# Altium schematic sheet IMU.SchDoc
size Tabloid; SheetNumber: 2; SheetTotal: 2
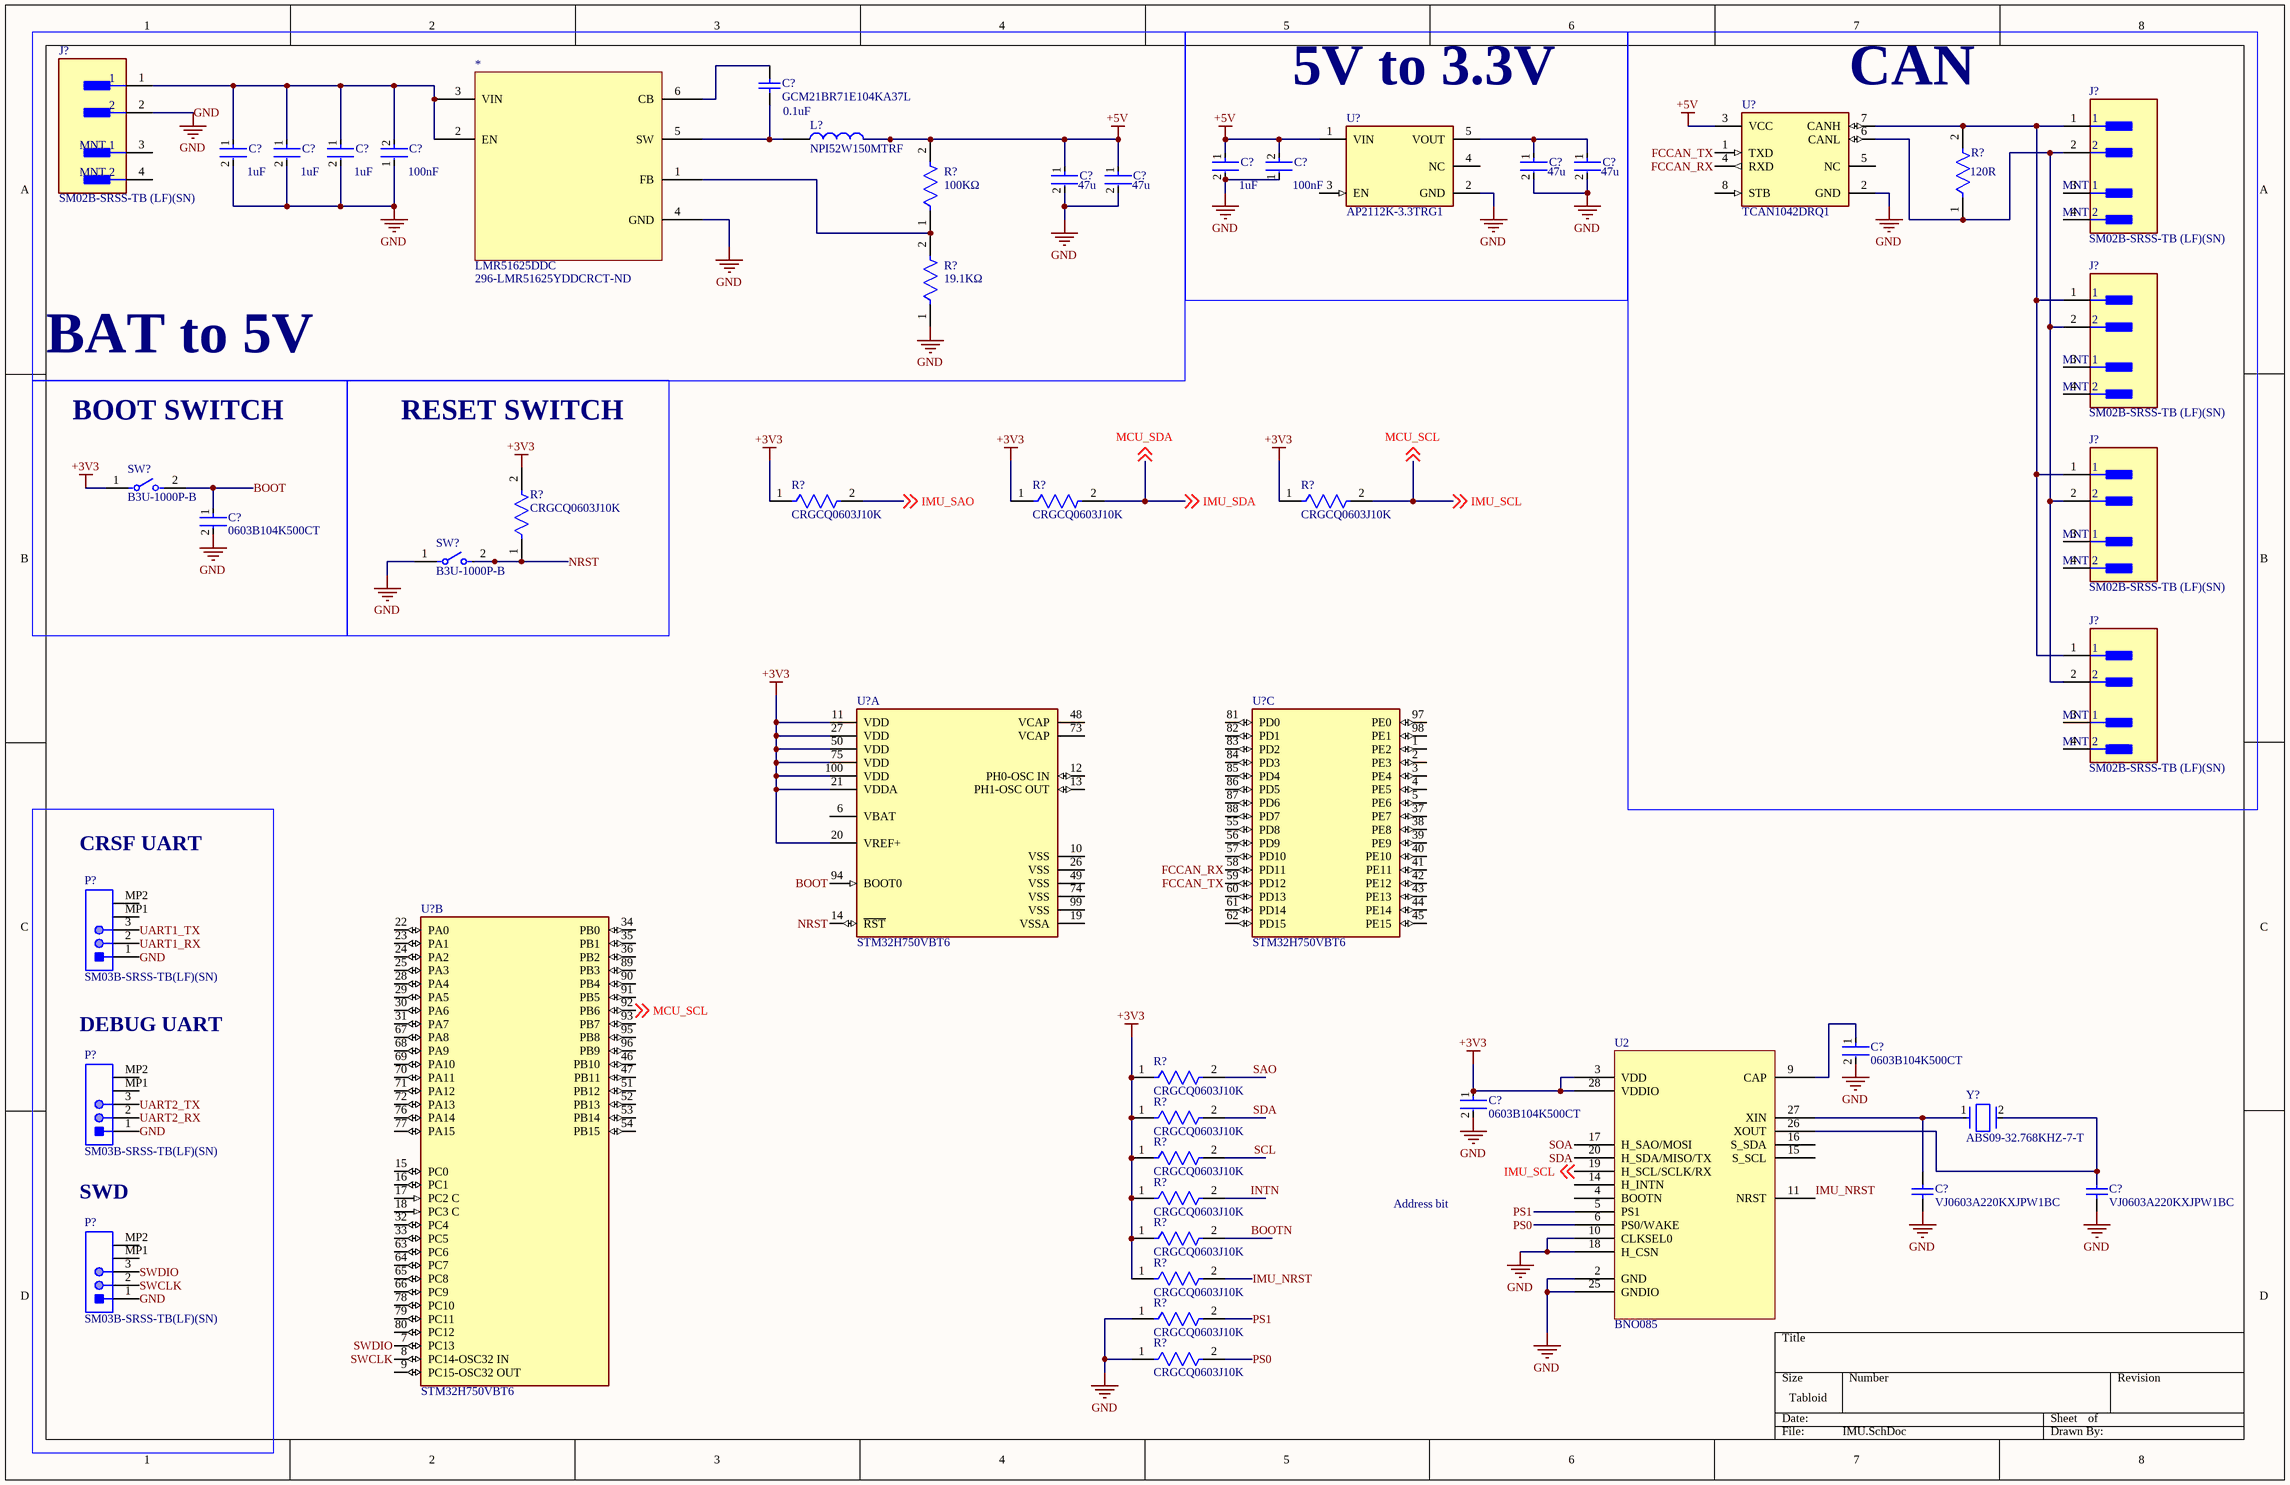
[diagram p0: IMU.SchDoc]

## Parts
(Parts that share a designator on the sheet are numbered #1, #2 ... from top to bottom, then left to right.)
*  LMR51625DDC  Supplier Part Number 1: 296-LMR51625YDDCRCT-ND  [SOT23-6]
C?#1  GCM21BR71E104KA37L  value 0.1uF  [CAPC2013X140X45LL15T25]
C?#2  Capacitance: 1uF  [FP-GCJ31M-0_3-IPC_C]  (hidden comment: GCJ31MR71H105KA12K)
C?#3  Capacitance: 1uF  [FP-GCJ31M-0_3-IPC_C]  (hidden comment: GCJ31MR71H105KA12K)
C?#4  Capacitance: 1uF  [FP-GCJ31M-0_3-IPC_C]  (hidden comment: GCJ31MR71H105KA12K)
C?#5  Capacitance: 100nF  [FP-C1608-080-0_1-IPC_B]  (hidden comment: C1608X7R1H104K080AA)
C?#6  Capacitance: 1uF  [FP-GCJ31M-0_3-IPC_C]  (hidden comment: GCJ31MR71H105KA12K)
C?#7  Capacitance: 100nF  [FP-C1608-080-0_1-IPC_B]  (hidden comment: C1608X7R1H104K080AA)
C?#8  Capacitance: 47u  [FP-GRJ32E-0_4-0_3-MFG]  (hidden comment: GRJ32ER71A476KE11K)
C?#9  Capacitance: 47u  [FP-GRJ32E-0_4-0_3-MFG]  (hidden comment: GRJ32ER71A476KE11K)
C?#10  Capacitance: 47u  [FP-GRJ32E-0_4-0_3-MFG]  (hidden comment: GRJ32ER71A476KE11K)
C?#11  Capacitance: 47u  [FP-GRJ32E-0_4-0_3-MFG]  (hidden comment: GRJ32ER71A476KE11K)
C?#12  0603B104K500CT  [FP-0603B104K500CT-IPC_C]
C?#13  0603B104K500CT  [FP-0603B104K500CT-IPC_C]
C?#14  0603B104K500CT  [FP-0603B104K500CT-IPC_C]
C?#15  VJ0603A220KXJPW1BC  [CAPC1608X95X40ML15T15]
C?#16  VJ0603A220KXJPW1BC  [CAPC1608X95X40ML15T15]
J?#1  SM02B-SRSS-TB (LF)(SN)  [FP-SM02B-SRSS-TB_LF_SN-MFG]
J?#2  SM02B-SRSS-TB (LF)(SN)  [FP-SM02B-SRSS-TB_LF_SN-MFG]
J?#3  SM02B-SRSS-TB (LF)(SN)  [FP-SM02B-SRSS-TB_LF_SN-MFG]
J?#4  SM02B-SRSS-TB (LF)(SN)  [FP-SM02B-SRSS-TB_LF_SN-MFG]
J?#5  SM02B-SRSS-TB (LF)(SN)  [FP-SM02B-SRSS-TB_LF_SN-MFG]
L?  NPI52W150MTRF  [NPI52W150MTRF]
P?#1  SM03B-SRSS-TB(LF)(SN)  [JST-SM03B-SRSS-TB_V]
P?#2  SM03B-SRSS-TB(LF)(SN)  [JST-SM03B-SRSS-TB_V]
P?#3  SM03B-SRSS-TB(LF)(SN)  [JST-SM03B-SRSS-TB_V]
R?#1  Resistance: 120R  [FP-RMCF0603-IPC_A]  (hidden comment: RMCF0603JT120R)
R?#2  value 100KΩ  [FP-CRGCQ0603-IPC_C]  (hidden comment: CRGCQ0603J100K)
R?#3  value 19.1KΩ  [FP-CPF0603-MFG]  (hidden comment: CPF0603F19K1C1)
R?#4  CRGCQ0603J10K  [FP-CRGCQ0603-IPC_C]
R?#5  CRGCQ0603J10K  [FP-CRGCQ0603-IPC_C]
R?#6  CRGCQ0603J10K  [FP-CRGCQ0603-IPC_C]
R?#7  CRGCQ0603J10K  [FP-CRGCQ0603-IPC_C]
R?#8  CRGCQ0603J10K  [FP-CRGCQ0603-IPC_C]
R?#9  CRGCQ0603J10K  [FP-CRGCQ0603-IPC_C]
R?#10  CRGCQ0603J10K  [FP-CRGCQ0603-IPC_C]
R?#11  CRGCQ0603J10K  [FP-CRGCQ0603-IPC_C]
R?#12  CRGCQ0603J10K  [FP-CRGCQ0603-IPC_C]
R?#13  CRGCQ0603J10K  [FP-CRGCQ0603-IPC_C]
R?#14  CRGCQ0603J10K  [FP-CRGCQ0603-IPC_C]
R?#15  CRGCQ0603J10K  [FP-CRGCQ0603-IPC_C]
SW?#1  B3U-1000P-B  [FP-B3U-1000P-B-MFG]
SW?#2  B3U-1000P-B  [FP-B3U-1000P-B-MFG]
U2  BNO085  [LGA28]
U?#1  TCAN1042DRQ1  [FP-D0008B-MFG]
U?#2  AP2112K-3.3TRG1  [FP-SOT25-IPC_A]
U?#3  STM32H750VBT6  [FP-LQFP100-1L-MFG]  (part A of 3)
U?#4  STM32H750VBT6  [FP-LQFP100-1L-MFG]  (part C of 3)
U?#5  STM32H750VBT6  [FP-LQFP100-1L-MFG]  (part B of 3)
Y?  ABS09-32.768KHZ-7-T  [FP-ABS09-MFG]

## Blocks framed on the sheet
5V to 3.3V: C?#6-C?#9 U?#2
CAN: J?#2-J?#5 R?#1 U?#1
BAT to 5V: C?#12 SW?#1
RESET SWITCH: R?#7 SW?#2

## Nets
+3V3: C?#14.1 R?#4.1 R?#5.1 R?#6.1 R?#7.2 R?#8.1 R?#9.1 R?#10.1 R?#11.1 R?#12.1 R?#13.1 SW?#1.1 U2.3(VDD) U2.28(VDDIO) U?#3.11(VDD) U?#3.20(VREF+) U?#3.21(VDDA) U?#3.27(VDD) U?#3.50(VDD) U?#3.75(VDD) U?#3.100(VDD)
+5V: C?#6.1 C?#7.2 C?#10.1 C?#11.1 L?.2 R?#2.2 U?#1.3(VCC) U?#2.1(VIN)
GND: *.4(GND) C?#2.2 C?#3.2 C?#4.2 C?#5.1 C?#6.2 C?#7.1 C?#8.2 C?#9.2 C?#10.2 C?#11.2 C?#12.2 C?#13.2 C?#14.2 C?#15.1 C?#16.1 J?#1.2 P?#1.1 P?#2.1 P?#3.1 R?#3.1 R?#14.1 R?#15.1 SW?#2.1 U2.2(GND) U2.10(CLKSEL0) U2.18(H_CSN) U2.25(GNDIO) U?#1.2(GND) U?#2.2(GND)
BOOT: C?#12.1 SW?#1.2 U?#3.94(BOOT0)
BOOTN: R?#12.2
FCCAN_RX: U?#1.4(RXD) U?#4.58(PD11)
FCCAN_TX: U?#1.1(TXD) U?#4.59(PD12)
IMU_NRST: R?#13.2 U2.11(NRST)
IMU_SAO: R?#4.2 ; off-sheet IMU_SAO
IMU_SCL: R?#6.2 U2.19(H_SCL/SCLK/RX) U?#5.92(PB6) ; off-sheet IMU_SCL, off-sheet MCU_SCL  [also labelled MCU_SCL]
IMU_SDA: R?#5.2 ; off-sheet IMU_SDA, off-sheet MCU_SDA  [also labelled MCU_SDA]
INTN: R?#11.2
NRST: R?#7.1 SW?#2.2 U?#3.14(~{RST})
PS0: R?#15.2 U2.6(PS0/WAKE)
PS1: R?#14.2 U2.5(PS1)
SAO: R?#8.2
SCL: R?#10.2
SDA: R?#9.2 U2.20(H_SDA/MISO/TX)
SOA: U2.17(H_SAO/MOSI)
SWCLK: P?#3.2 U?#5.8(PC14-OSC32_IN)
SWDIO: P?#3.3 U?#5.7(PC13)
UART1_RX: P?#1.2
UART1_TX: P?#1.3
UART2_RX: P?#2.2
UART2_TX: P?#2.3
Net*_1: *.1(FB) R?#2.1 R?#3.2
Net*_2: *.2(EN) *.3(VIN) C?#2.1 C?#3.1 C?#4.1 C?#5.2 J?#1.1
Net*_5: *.5(SW) C?#1.1 L?.1
Net*_6: *.6(CB) C?#1.2
NetC?#8_1: C?#8.1 C?#9.1 U?#2.5(VOUT)
NetC?#13_1: C?#13.1 U2.9(CAP)
NetC?#15_2: C?#15.2 U2.27(XIN) Y?.1
NetC?#16_2: C?#16.2 U2.26(XOUT) Y?.2
NetJ?#2_1: J?#2.1 J?#3.1 J?#4.1 J?#5.1 R?#1.2 U?#1.7(CANH)
NetJ?#2_2: J?#2.2 J?#3.2 J?#4.2 J?#5.2 R?#1.1 U?#1.6(CANL)

Not connected (* = marked no-connect by the designer): J?#1 3(MNT_1) 4(MNT_2); J?#2 3(MNT_1) 4(MNT_2); J?#3 3(MNT_1) 4(MNT_2); J?#4 3(MNT_1) 4(MNT_2); J?#5 3(MNT_1) 4(MNT_2); P?#1 MP1 MP2; P?#2 MP1 MP2; P?#3 MP1 MP2; U2 4(BOOTN) 14(H_INTN) 15(S_SCL) 16(S_SDA); U?#1 5(NC) 8(STB); U?#2 3(EN) 4(NC); U?#3 6(VBAT) 10(VSS) 12(PH0-OSC_IN) 13(PH1-OSC_OUT) 19(VSSA) 26(VSS) 48(VCAP) 49(VSS) 73(VCAP) 74(VSS) 99(VSS); U?#4 1(PE2) 2(PE3) 3(PE4) 4(PE5) 5(PE6) 37(PE7) 38(PE8) 39(PE9) 40(PE10) 41(PE11) 42(PE12) 43(PE13) 44(PE14) 45(PE15) 55(PD8) 56(PD9) 57(PD10) 60(PD13) 61(PD14) 62(PD15) 81(PD0) 82(PD1) 83(PD2) 84(PD3) 85(PD4) 86(PD5) 87(PD6) 88(PD7) 97(PE0) 98(PE1); U?#5 9(PC15-OSC32_OUT) 15(PC0) 16(PC1) 17(PC2_C) 18(PC3_C) 22(PA0) 23(PA1) 24(PA2) 25(PA3) 28(PA4) 29(PA5) 30(PA6) 31(PA7) 32(PC4) 33(PC5) 34(PB0) 35(PB1) 36(PB2) 46(PB10) 47(PB11) 51(PB12) 52(PB13) 53(PB14) 54(PB15) 63(PC6) 64(PC7) 65(PC8) 66(PC9) 67(PA8) 68(PA9) 69(PA10) 70(PA11) 71(PA12) 72(PA13) 76(PA14) 77(PA15) 78(PC10) 79(PC11) 80(PC12) 89(PB3) 90(PB4) 91(PB5) 93(PB7) 95(PB8) 96(PB9)

## Notes on the sheet
- BOOT SWITCH
- (near P?#1) CRSF UART
- (near P?#2) DEBUG UART
- (near P?#3) SWD
- Address bit

## Library data of the parts
* = LMR51625DDC: LMR516x5 4.3V to 60V, 2.5A / 3.5A, Synchronous, Buck Converter With Low IQ; Data: *; Supplier 1: DigiKey
C?#1 = CMP-2007-03344-1: Manufacturer: Murata; Part Number: GCM21BR71E104KA37L
C?#2-C?#4 C?#6 = CMP-06035-033047-1: 1uF +/- 10% Ceramic Capacitor, 50VDC, X7R Temperature Coefficient 15% Op Temp -55 to +125°C, 1206 Packaging
C?#5 C?#7 = CMP-2000-04982-2: Multilayer Ceramic Capacitors 100nF ±10% 50V X7R SMD 0603; REACH SVHC: No SVHC; Voltage: 50V; Min Operating Temperature: -55°C; Package Quantity: 1; Case Code (Metric): 1608; Series: C; Termination: SMD/SMT; Length: 1.6mm; Voltage Rating: 50V; Case Code (Imperial): 0603; Number of Pins: 2; RoHS Compliant: Yes; Thickness: 0.037inch; Resistor Type: Ceramic; Radiation Hardening: No; Weight: 7.1E-05oz; Mount: Surface Mount; Voltage Rating (DC): 50V; Construction: Flat; Tolerance: 10%; Lead Free: Lead Free; Case/Package: 0603; Max Operating Temperature: 125°C; Height: 0.8mm; Depth: 0.8mm; Packaging: Tape and Reel; Width: 0.031inch; Dielectric Material: Ceramic; Dielectric: X7R
C?#8-C?#11 = CMP-06035-062475-1: CAP CER MLCC; RoHS Compliant: Yes
C?#12-C?#14 = CMP-45632-000007-1: CAP CER 0.1UF 50V X7R 0603; Tolerance: 10%; Capacitance: 100nF; Radiation Hardening: No; Depth: 0.8mm; Length: 1.6mm; Voltage Rating: 50V; Dielectric: X7R; Case/Package: 0603; RoHS Compliant: Yes; Case Code (Metric): 1608; Voltage Rating (DC): 50V; Min Operating Temperature: -55°C; Series: -; Max Operating Temperature: 125°C; Lead Free: Lead Free; Case Code (Imperial): 0603; Packaging: Tape and Reel
C?#15 C?#16 = CMP-2006-01608-1: Manufacturer: Vitramon; Part Number: VJ0603A220KXJPW1BC
J?#1-J?#5 = CMP-17439-000368-1: CONN HEADER SMD R/A 2POS 1MM; Max Current Rating: 1A; Voltage Rating (AC): 50V; Current Rating: 700mA; Contact Resistance: 40mR; Number of Positions: 2; Insulation Resistance: 100MR; Fastening Type: Pull; Orientation: Right Angle; Insulation Color: Natural; Insulation Material: Nylon; Connector Type: Header; Contact Type: Male Pin; Number of Rows: 1; Housing Material: Polyamide; Contact Material: Copper Alloy; Mount: Surface Mount; Packaging: Tape and Reel; Lead Pitch: 1mm; REACH SVHC: No SVHC; Flammability Rating: UL94 V-0; Termination: Solder; Series: SR; Length: 4mm; Color: Natural; Min Operating Temperature: -25°C; Pitch: 1mm; Depth: 4.95mm; Contact Plating: Tin; Lead Free: Lead Free; Max Operating Temperature: 85°C; Contact Finish - Mating: TIN; Material: Polyamide; Voltage Rating: 50V; Max Voltage Rating (AC): 50V; Housing Color: Beige; Contact Shape: Square; Number of Contacts: 2
L? = NPI52W150MTRF: Power Inductor (SMD), 15 uH, +/- 20%, 4 A, Unshielded, 8 A, 18.4mm x 15mm x 7mm; Manufacturer_Name: NIC Components; Geometry.Height: 7.5mm; Manufacturer_Part_Number: NPI52W150MTRF; Mouser Part Number: *; Mouser Price/Stock: *; Arrow Part Number: NPI52W150MTRF; Arrow Price/Stock: https://www.arrow.com/en/products/npi52w150mtrf/nic-components?utm_currency=USD&region=nac; Datasheet Link: https://www.niccomp.com/products/catalog/npi_w.pdf
P?#1-P?#3 = CMP-2000-07077-1: Male Header, Pitch 1 mm, 1 x 3 Position, Height 2.9 mm, -25 to 85 degC, RoHS, Tape and Reel; Manufacturer: JST; Pitch: 1mm; Style/Orientation: RightAngleHeader/Plug; No of Positions: 3; Package Description: Male Header, Pitch 1 mm, 1 x 3 Position, Height 2.9 mm; Manufacturer URL: http://www.jst.com/home2.html; Package Reference: SM03B-SRSS-TB; Type: ShroudedHeader; Termination: Crimp; Mounting Technology: SurfaceMount; Datasheet Version: 11/2010; Datasheet URL: https://datasheet.ciiva.com/26894/getdatasheetpartid-708885-26894671.pdf
R?#1 = CMP-26527-001340-1: 120Ω ±5% 0.1W 0603 Thick Film Chip Resistor AEC-Q200 compliant; Power Rating: 100mW; Temperature Coefficient: 100ppm/°C; Packaging: Tape and Reel; Series: RMCF; Features: Automotive AEC-Q200; Size Code: 0603; Case Code (Metric): 1608; Case/Package: 0603; Resistor Type: Thick Film; Height: 0.022inch; Length: 0.061inch; Number of Terminations: 2; Max Operating Temperature: 155°C; RoHS Compliant: Yes; Mount: Surface Mount; Case Code (Imperial): 0603; Tolerance: 5%; Contact Plating: Tin; Radiation Hardening: No; Max Power Dissipation: 100mW; Lead Free: Lead Free; Width: 0.031inch; Min Operating Temperature: -55°C
R?#2 = CMP-03211-009800-1: CRGCQ 0603 100K 5%; Manufacturer: TE Connectivity; Tolerance: 0.05; Voltage Rating: 75V; Power Rating: 0.1W; Temperature Coefficient: ±100ppm/°C; Device Class L2: Resistors; Lead Free: Yes; Temperature Range High: +155°C; Device Class L3: Chip SMD Resistors; Device Class L1: Passive Components; RoHS: TRUE; Category: Res; Temperature Range Low: -55°C; ComponentLink2Description: Datasheet; Octopart: https://octopart.com/crgcq0603j100k-te+connectivity-91018095; Series: CRGCQ; Ipc Land Pattern Name: RESC16080X45; Digikey Description: CRGCQ 0603 100K 5%; Temperature: -55°C to +155°C; Manufacturer Part Number: CRGCQ0603J100K; Ambient Temperature Range High: +70°C; Composition: Thick Film; Resistance: 100KΩ; Package: CRGCQ0603; ComponentLink2URL: https://www.te.com/commerce/DocumentDelivery/DDEController?Action=showdoc&DocId=Data+Sheet%7F1773204-3%7F1%7Fpdf%7FEnglish%7FENG_DS_1773204-3_1.pdf%7F4-2176339-1151; Height: 0.55mm; Mouser Description: Res, Aec-Q200, Thick Film, 100K, 5%, 0603
R?#3 = CMP-03211-007694-1: RES SMD 19.1KΩ 1% 1/16W 0603; Manufacturer: TE Connectivity; Power Rating: 0.063W; Temperature Coefficient: 50ppm/°C; Voltage Rating: 50V; Composition: Thin Film; Octopart: https://octopart.com/cpf0603f19k1c1-te+connectivity-7514725; Temperature Range High: +155°C; Category: Res; Package: CPF0603; ComponentLink2URL: https://www.te.com/commerce/DocumentDelivery/DDEController?Action=showdoc&DocId=Data+Sheet%7F1773200%7FM%7Fpdf%7FEnglish%7FENG_DS_1773200_M.pdf%7F3-1676481-2; Automotive: No; Height: 0.55mm; octopart_url: https://octopart.com/cpf0603f19k1c1-te+connectivity-7514725; Manufacturer Part Number: CPF0603F19K1C1; Ipc Land Pattern Name: RESC15580X45; Tolerance: 1%; Temperature: -55°C to +155°C; packaging: 1k Reel; ComponentLink2Description: Datasheet; Temperature Range Low: -55°C; RoHS: TRUE; Resistance: 19.1KΩ; Series: CPF; Device Class L2: Resistors; Device Class L1: Passive Components; Lead Free: Yes; Device Class L3: Chip SMD Resistors
R?#4-R?#15 = CMP-03211-009884-1: CRGCQ 0603 10K 5%; Manufacturer: TE Connectivity; Tolerance: 0.05; Power Rating: 0.1W; Resistance: 10KΩ; Voltage Rating: 75V; Value: 10KΩ; Temperature Coefficient: ±100ppm/°C; Composition: Thick Film; ComponentLink2URL: https://www.te.com/commerce/DocumentDelivery/DDEController?Action=showdoc&DocId=Data+Sheet%7F1773204-3%7F1%7Fpdf%7FEnglish%7FENG_DS_1773204-3_1.pdf%7F4-2176339-923; Device Class L1: Passive Components; Package: CRGCQ0603; Mouser Description: Res Thick Film 0603 10K Ohm 5% 0.1W(1/10W) ±100ppm/C Pad SMD Automotive T/R; Temperature Range High: +155°C; Category: Res; Device Class L2: Resistors; Height: 0.55mm; RoHS: TRUE; Lead Free: Yes; Ipc Land Pattern Name: RESC16080X45; Temperature: -55°C to +155°C; Series: CRGCQ; Digikey Description: CRGCQ 0603 10K 5%; Octopart: https://octopart.com/crgcq0603j10k-te+connectivity-91018097; Device Class L3: Chip SMD Resistors; Ambient Temperature Range High: +70°C; ComponentLink2Description: Datasheet; Temperature Range Low: -55°C; Manufacturer Part Number: CRGCQ0603J10K
SW?#1 SW?#2 = CMP-08834-000005-1: SWITCH TACTILE SPST-NO 0.05A 12V; Manufacturer: Omron; Operating Force: 1.5N; Contact Current Rating: 50mA; Contact Resistance: 100mΩ; Electromechanical Life: 200000Cycles; Height: 1.75mm; Device Class L2: Switches; Temperature Range High: +70°C; Digikey Description: SWITCH TACTILE SPST-NO 0.05A 12V; Throw Configuration: SPST-NO; Ambient Temperature Range High: +70°C; Temperature: -25°C to +70°C; Lead Free: Yes; ComponentLink2URL: https://omronfs.omron.com/en_US/ecb/products/pdf/en-b3u.pdf; Device Class L3: Tactile Switches; Manufacturer Part Number: B3U-1000P-B; Ambient Temperature Range Low: -25°C; Mount: Surface Mount; Automotive: No; Mouser Description: Tactile Switches Top Actuated with boss w/o ground; Octopart: https://octopart.com/b3u-1000p-b-omron-1057356; RoHS: TRUE; Package: 0; Device Class L1: Electromechanical; Voltage Rating Dc: 12V; Category: Switch; Temperature Range Low: -25°C; ComponentLink2Description: Datasheet
U?#1 = CMP-04872-000012-1: IC TRANSCEIVER 1/1 8SOIC; Manufacturer: Texas Instruments; Min Supply Voltage: 4.5V; Interface: CAN; Automotive Grade: Grade 1; Standoff Height: 0.11mm; Max Supply Voltage: 5.5V; Max Junction Temp: +150°C; Nominal Supply Current: 1.5-45mA; Lead Free: Yes; Digikey Description: IC TRANSCEIVER 1/1 8SOIC; ComponentLink2URL: http://www.ti.com/lit/ds/symlink/tcan1042-q1.pdf; RoHS: TRUE; Device Class L3: unset; ComponentLink2Description: Datasheet; Temperature Range Low: -55°C; Temperature Range High: +125°C; Manufacturer Part Number: TCAN1042DRQ1; Height: 1.75mm; Automotive: Yes; Ambient Temperature Range Low: -40°C; Temperature: -55°C to +125°C; Package: D0008B; Octopart: https://octopart.com/tcan1042drq1-texas+instruments-71144522; Device Class L1: Integrated Circuits (ICs); Device Class L2: Interface ICs; Category: IC; Ambient Temperature Range High: +125°C
U?#2 = CMP-12756-000035-1: IC REG LINEAR 3.3V 600MA SOT25; Number of Regulators: 1; Output Type: Fixed; Polarity: Positive; Min Input Voltage: 2.5V; Max Input Voltage: 6V; Accuracy: 1.5%; Quiescent Current: 55uA; Dropout Voltage: 250mV; Min Operating Temperature: -40°C; Length: 3.1mm; Output Current: 600mA; Max Operating Temperature: 85°C; Package Quantity: 1; Output Voltage: 3.3V; Width: 1.7mm; Number of Outputs: 1; Packaging: Tape and Reel; Height: 1.3mm; Lead Free: Lead Free; Max Output Current: 600mA; Case/Package: SOT-23-5; Mount: Surface Mount; Number of Pins: 5
U?#3-U?#5 = CMP-12105-000017-1: IC MCU 32BIT 128KB FLASH 100LQFP; Manufacturer: STMicroelectronics; Number Of Uart Channels: 9; Number Of I/Os: 82; Max Junction Temp: +125°C; Data Bus Width: 32bits; Ram Size: 1MBytes; Min Supply Voltage: 1.62V; Number Of Spi Channels: 6; Number Of Adc Channels: 36; Max Supply Voltage: 3.6V; Standoff Height: 0.05mm; Interface: I2C,SPI,UART,USART,CAN,USB,LIN,IrDA,Ethernet,I2S,Other; Number Of A/D Converters: 3; Number Of I2C Channels: 4; Memory Size: 128KBytes; Frequency: 480MHz; Number Of Timers/Counters: 20; Number Of Ethernet Channels: 1; Core Architecture: ARM Cortex-M7; Number Of Usb Channels: 2; Number Of Pwm Channels: 42; Ambient Temperature Range High: +85°C; Temperature: -40°C to +125°C; ComponentLink2URL: https://www.st.com/resource/en/datasheet/stm32h750vb.pdf; Device Class L2: Embedded Processors and Controllers; Temperature Range Low: -40°C; Octopart: https://octopart.com/stm32h750vbt6-stmicroelectronics-94048547; Category: IC; Manufacturer Part Number: STM32H750VBT6; Height: 1.6mm; Lead Free: Yes; Device Class L1: Integrated Circuits (ICs); Digikey Description: IC MCU 32BIT 128KB FLASH 100LQFP; RoHS: TRUE; Ambient Temperature Range Low: -40°C; Device Class L3: Microcontrollers; ComponentLink2Description: Datasheet; Mouser Description: MCU 32-Bit STM32H750VB ARM Cortex M7 RISC 128KB Flash 1.8V/2.5V/3.3V 100-Pin LQFP Tray; Number Of Cores: 1; Automotive: No; Memory Type: FLASH; Package: LQFP100-1L; Temperature Range High: +125°C
Y? = CMP-27762-002676-1: CRYSTAL 32.7680KHZ 7PF SMD; ESR (Equivalent Series Resistance): 70kR; Frequency Tolerance: 20ppm; Series: ABS09; Lead Free: Lead Free; Number of Pins: 2; Length: 0.161inch; RoHS Compliant: Yes; Width: 1.5mm; Mount: Surface Mount; Frequency: 32.768kHz; Packaging: Tape and Reel; Case/Package: SMD/SMT; Series Resistance: 70kR; Package Quantity: 3000; Min Operating Temperature: -40°C; Height: 0.035inch; Max Operating Temperature: 85°C; Tolerance: 20ppm; Termination: SMD/SMT; Frequency Stability: 20ppm; Operating Frequency: 32.768 kHz; Load Capacitance: 7pF